# Altium schematic sheet 0260_GPU VREG_ VCCSA_GP.SchDoc
size 848 x 558 mm
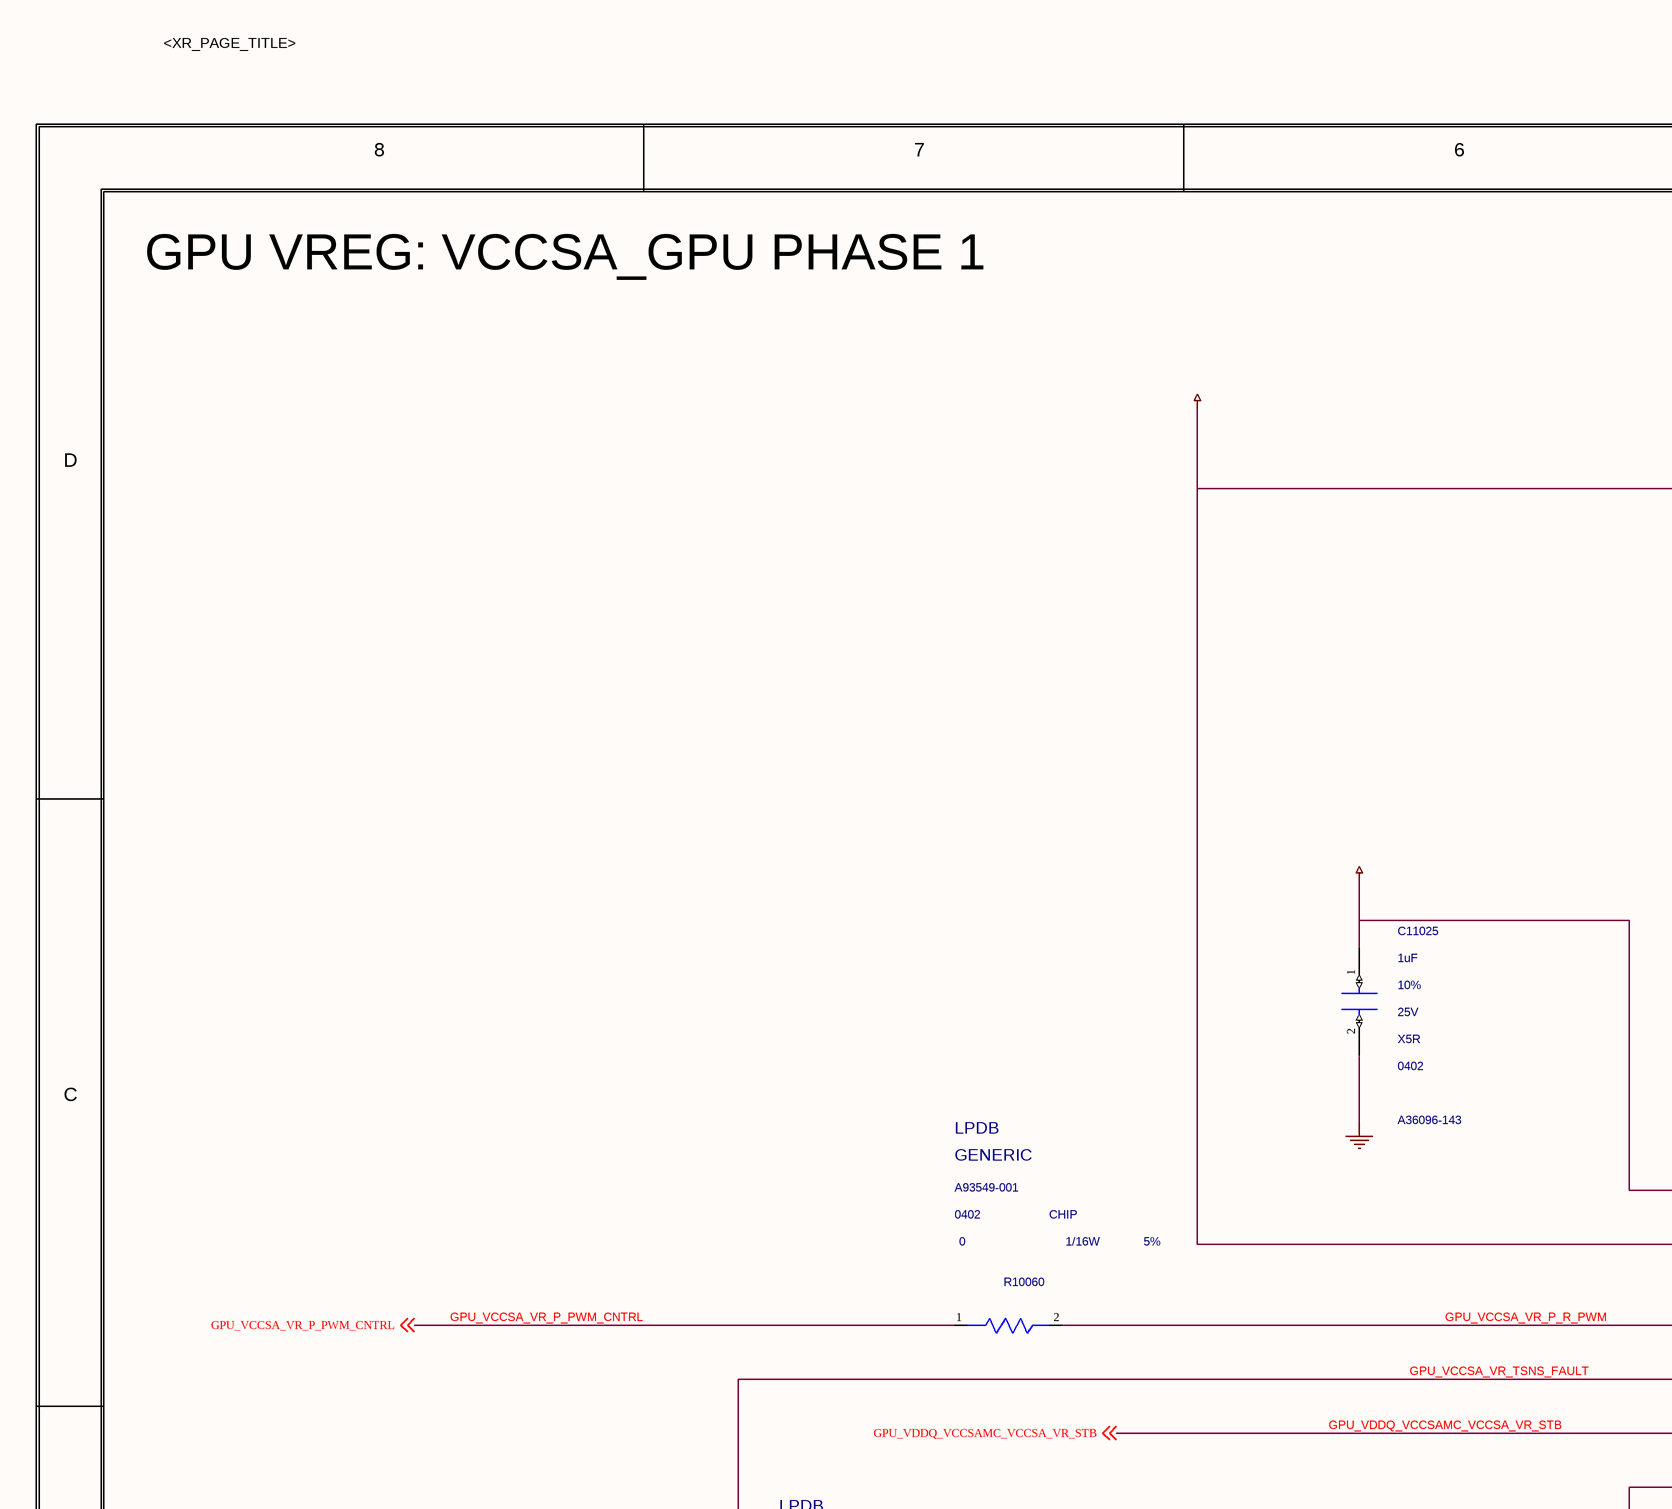
[diagram p0: 0260_GPU VREG_ VCCSA_GP.SchDoc, top left]
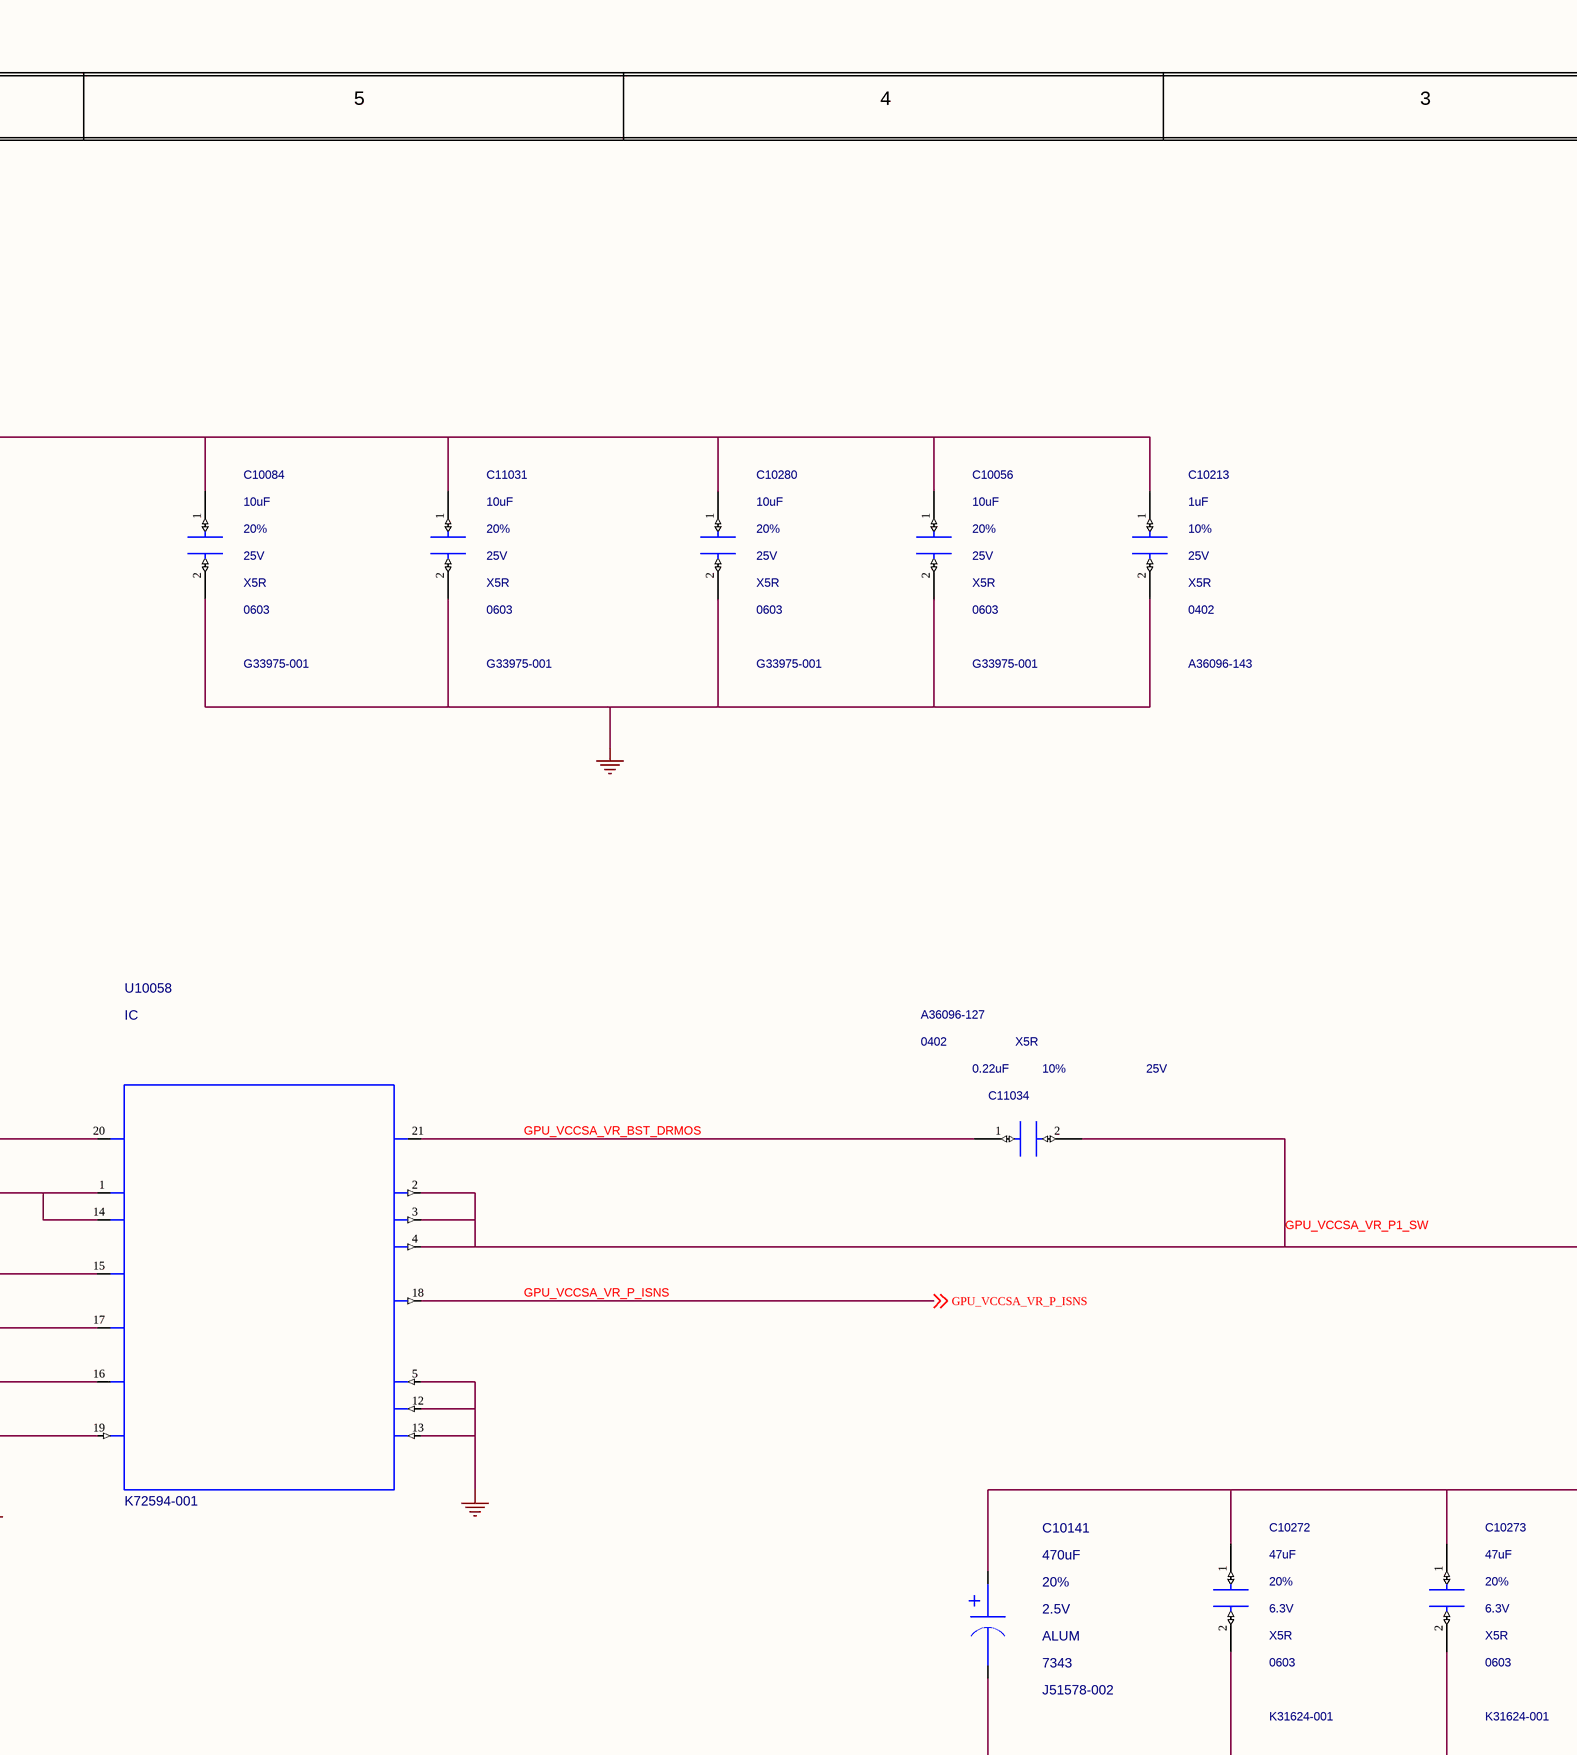
[diagram p1: 0260_GPU VREG_ VCCSA_GP.SchDoc, top middle]
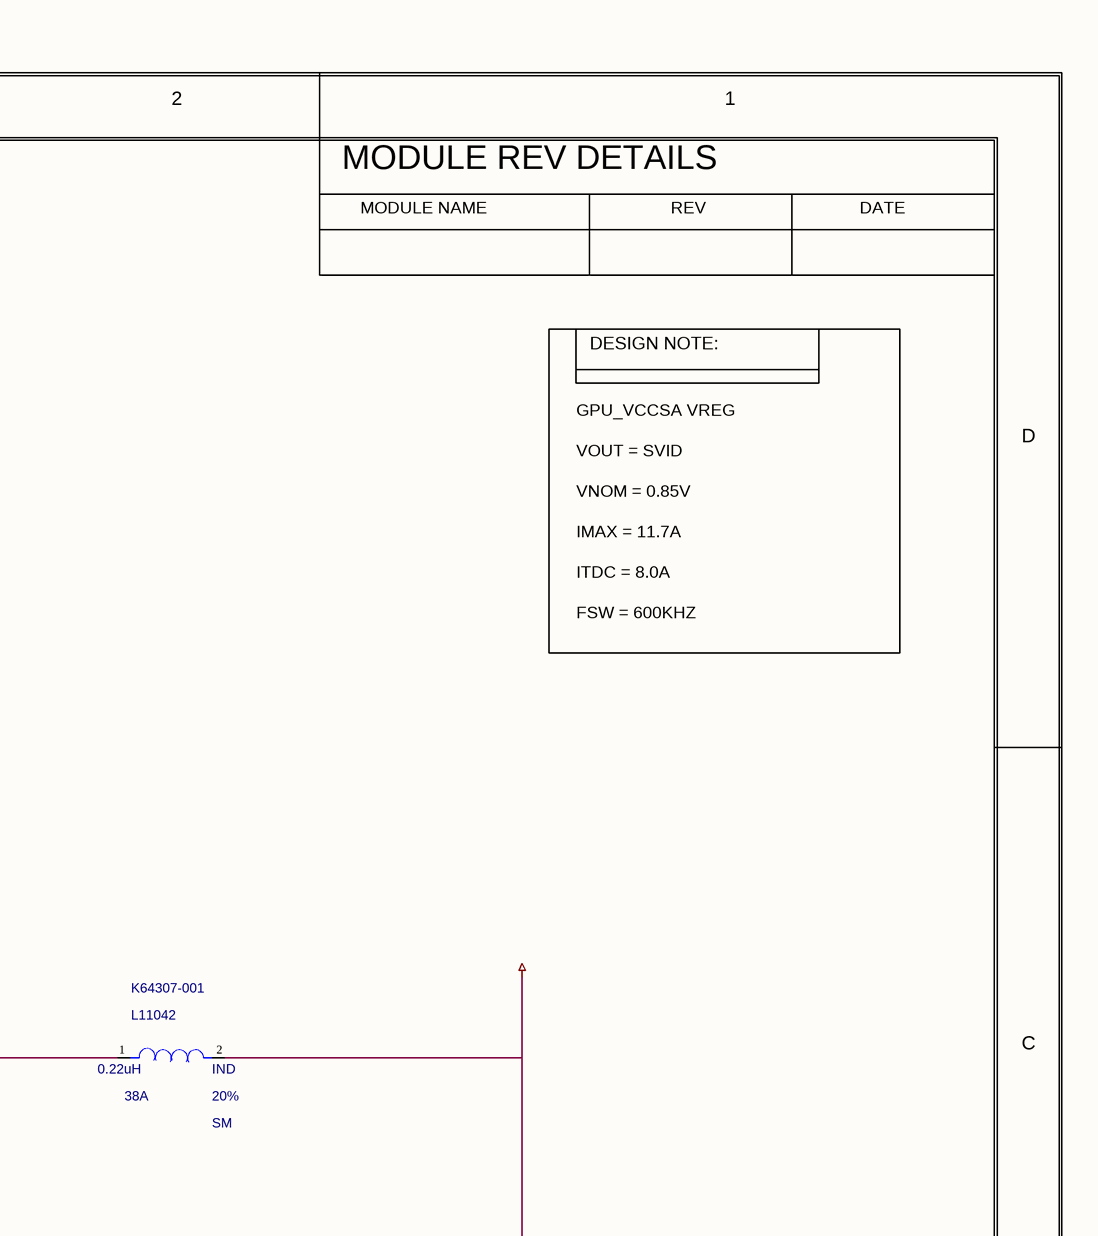
[diagram p2: 0260_GPU VREG_ VCCSA_GP.SchDoc, top right]
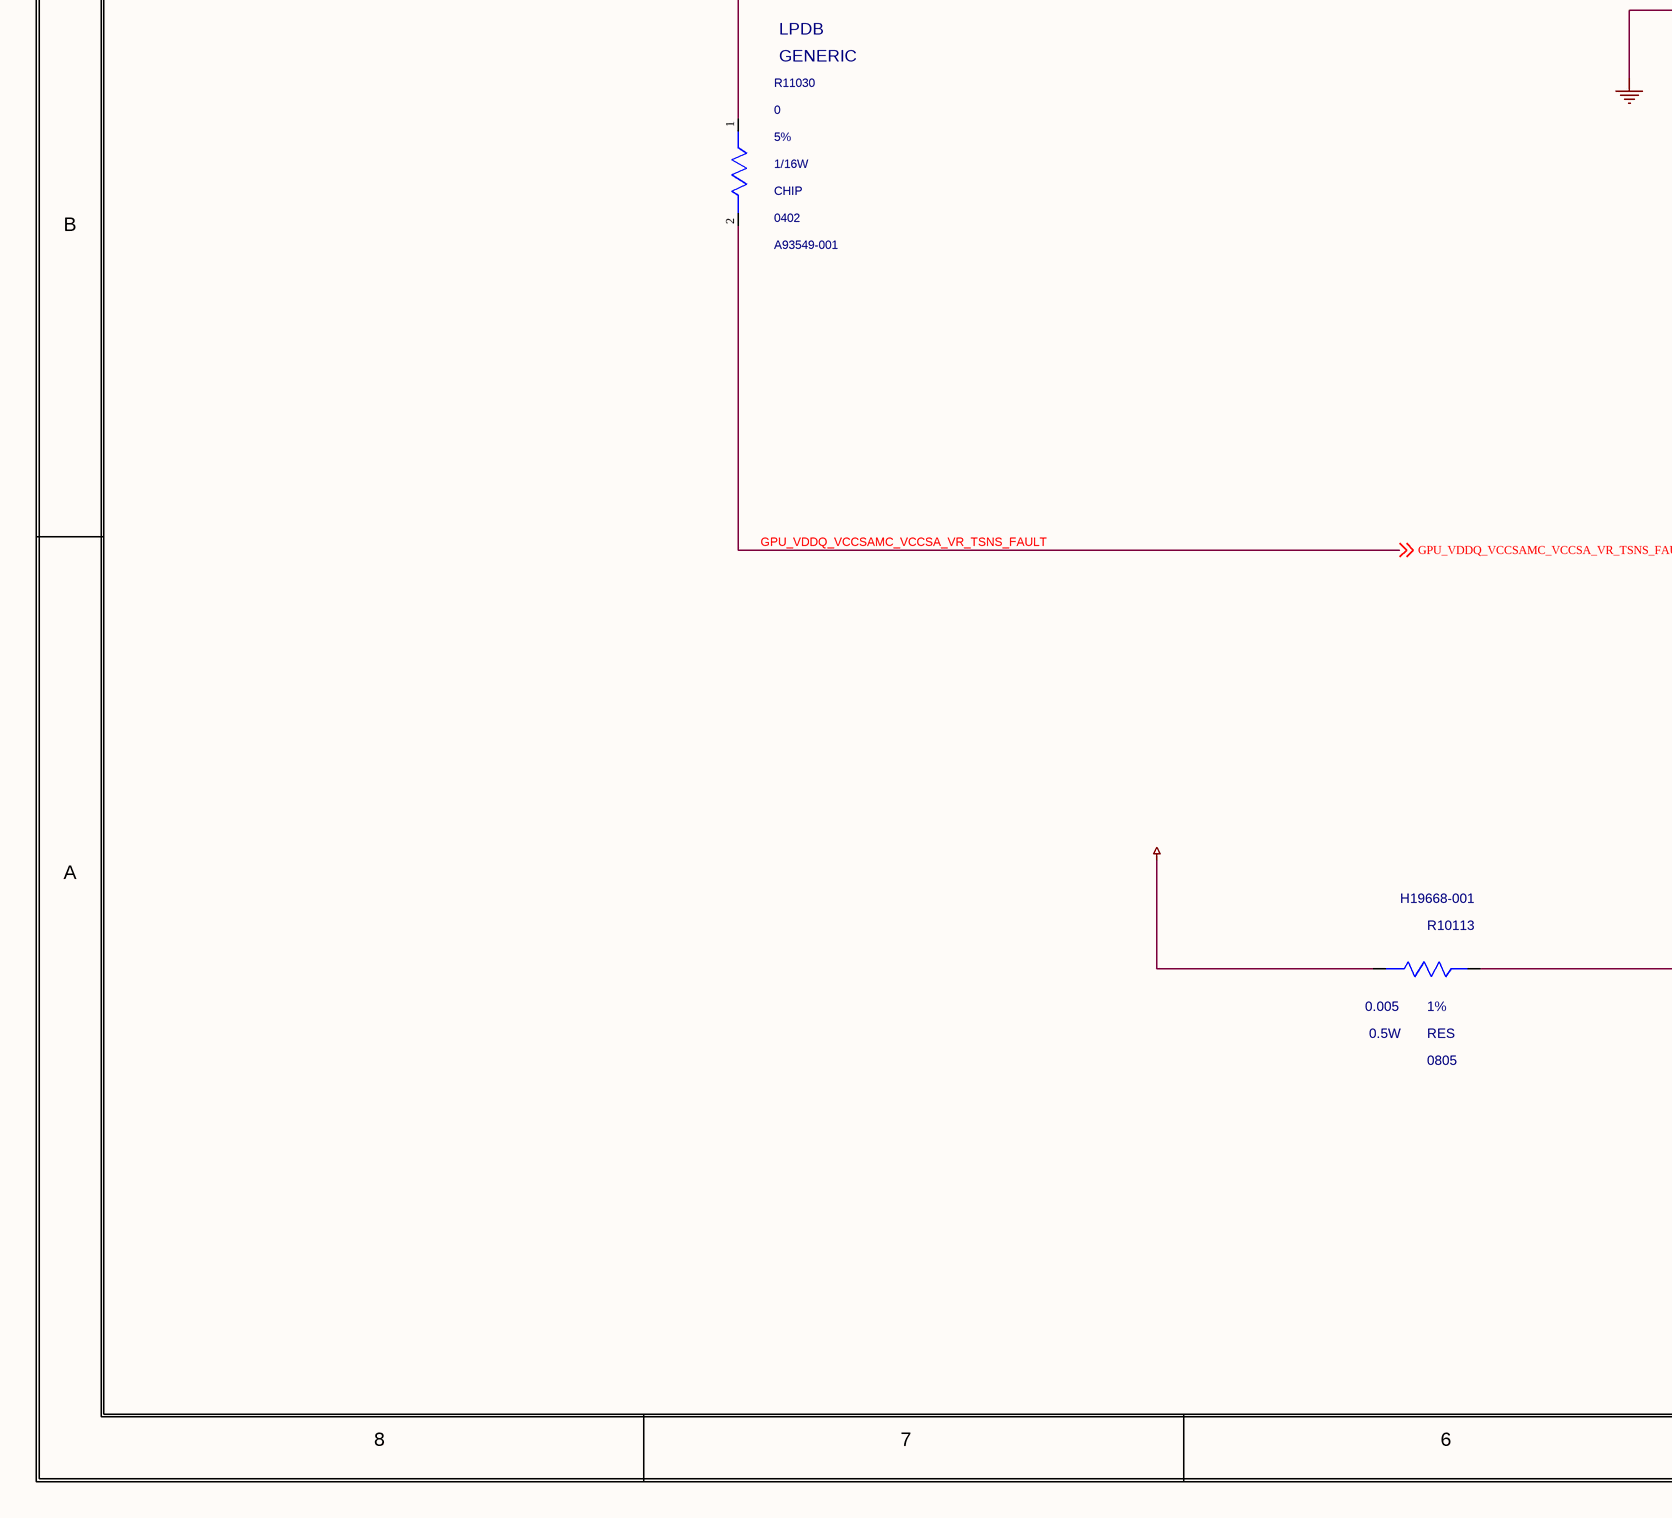
[diagram p3: 0260_GPU VREG_ VCCSA_GP.SchDoc, bottom left]
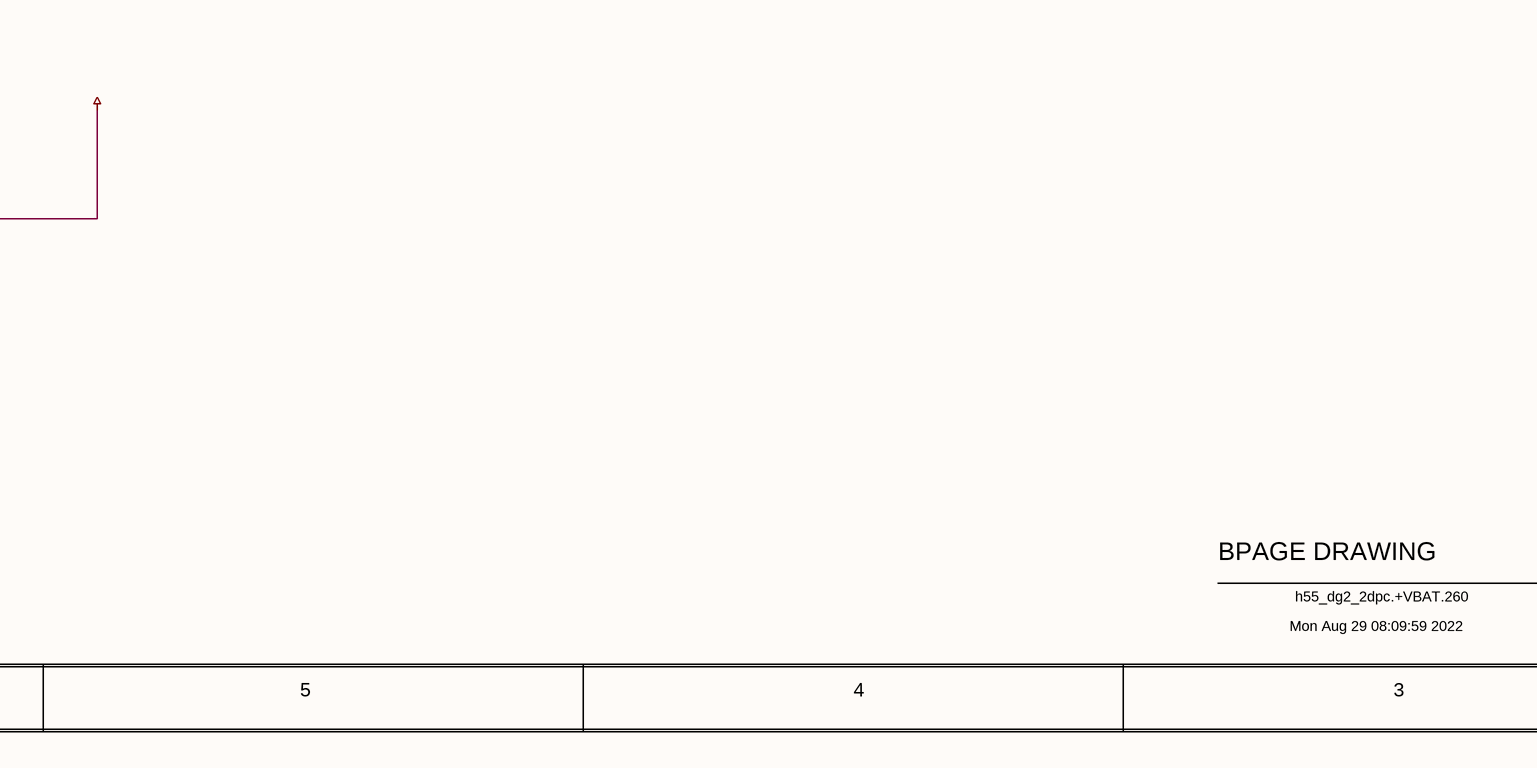
[diagram p4: 0260_GPU VREG_ VCCSA_GP.SchDoc, bottom middle]
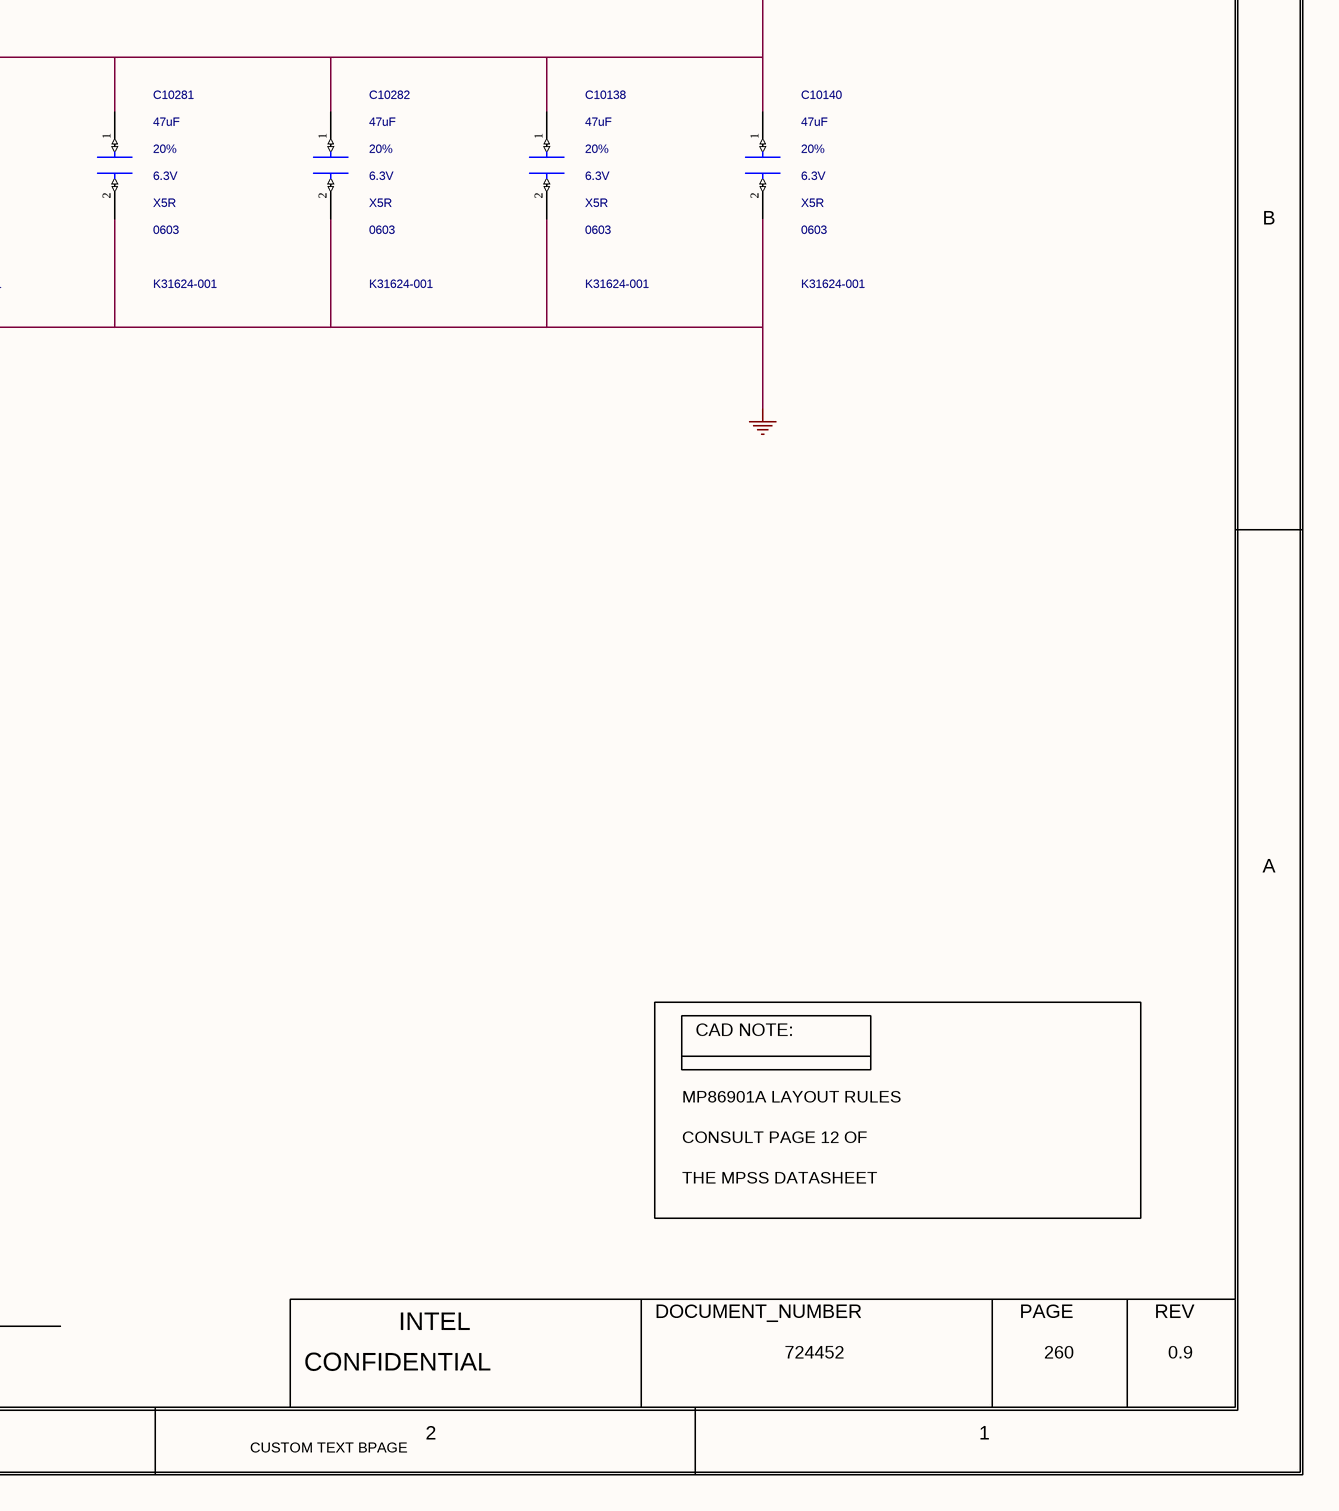
[diagram p5: 0260_GPU VREG_ VCCSA_GP.SchDoc, bottom right]

## Parts
C10056  10uF  MATERIAL: X5R  PACK_TYPE: 0603  PART_NUMBER: G33975-001  TOLERANCE: 20%  VOLTAGE: 25V  [SMC0603IA]
C10084  10uF  MATERIAL: X5R  PACK_TYPE: 0603  PART_NUMBER: G33975-001  TOLERANCE: 20%  VOLTAGE: 25V  [SMC0603IA]
C10138  47uF  MATERIAL: X5R  PACK_TYPE: 0603  PART_NUMBER: K31624-001  TOLERANCE: 20%  VOLTAGE: 6.3V  [SMC0603ID]
C10140  47uF  MATERIAL: X5R  PACK_TYPE: 0603  PART_NUMBER: K31624-001  TOLERANCE: 20%  VOLTAGE: 6.3V  [SMC0603ID]
C10141  470uF  MATERIAL: ALUM  PACK_TYPE: 7343  PART_NUMBER: J51578-002  TOLERANCE: 20%  VOLTAGE: 2.5V  [CTK2_SMC_7500X4500_ALEL_MA]
C10213  1uF  MATERIAL: X5R  PACK_TYPE: 0402  PART_NUMBER: A36096-143  TOLERANCE: 10%  VOLTAGE: 25V  [SMC0402MA]
C10272  47uF  MATERIAL: X5R  PACK_TYPE: 0603  PART_NUMBER: K31624-001  TOLERANCE: 20%  VOLTAGE: 6.3V  [SMC0603ID]
C10273  47uF  MATERIAL: X5R  PACK_TYPE: 0603  PART_NUMBER: K31624-001  TOLERANCE: 20%  VOLTAGE: 6.3V  [SMC0603ID]
C10280  10uF  MATERIAL: X5R  PACK_TYPE: 0603  PART_NUMBER: G33975-001  TOLERANCE: 20%  VOLTAGE: 25V  [SMC0603IA]
C10281  47uF  MATERIAL: X5R  PACK_TYPE: 0603  PART_NUMBER: K31624-001  TOLERANCE: 20%  VOLTAGE: 6.3V  [SMC0603ID]
C10282  47uF  MATERIAL: X5R  PACK_TYPE: 0603  PART_NUMBER: K31624-001  TOLERANCE: 20%  VOLTAGE: 6.3V  [SMC0603ID]
C11025  1uF  MATERIAL: X5R  PACK_TYPE: 0402  PART_NUMBER: A36096-143  TOLERANCE: 10%  VOLTAGE: 25V  [SMC0402MA]
C11031  10uF  MATERIAL: X5R  PACK_TYPE: 0603  PART_NUMBER: G33975-001  TOLERANCE: 20%  VOLTAGE: 25V  [SMC0603IA]
C11034  0.22uF  MATERIAL: X5R  PACK_TYPE: 0402  PART_NUMBER: A36096-127  TOLERANCE: 10%  VOLTAGE: 25V  [SMC1005MB]
L11042  0.22uH  CURRENT: 38A  MATERIAL: IND  PACK_TYPE: SM  PART_NUMBER: K64307-001  TOLERANCE: 20%  [CTK2_SM_7600X6800_MA]
R10060  0  MATERIAL: CHIP  PACK_TYPE: 0402  PART_NUMBER: A93549-001  TOLERANCE: 5%  WATTAGE: 1/16W  IP: GENERIC  FP_TECH: LPDB  [SMR0402IA]
R10113  0.005  MATERIAL: RES  PACK_TYPE: 0805  PART_NUMBER: H19668-001  TOLERANCE: 1%  WATTAGE: 0.5W  [CTK2_SM0805_2150X1350_MA]
R11030  0  MATERIAL: CHIP  PACK_TYPE: 0402  PART_NUMBER: A93549-001  TOLERANCE: 5%  WATTAGE: 1/16W  IP: GENERIC  FP_TECH: LPDB  [SMR0402IA]
U10058  MATERIAL: IC  PART_NUMBER: K72594-001  [CTK1_LCC21_3100X4100_400_DF3P_MA_VR]  (hidden comment: C_MP86901)

## Nets
+V3P3S_GPU: C11025.1(A) U10058.20(VCC)
+VBATA_DG2: R10113.1(A)
+VBATA_VCCSA_GPU: C10056.1(A) C10084.1(A) C10213.1(A) C10280.1(A) C11031.1(A) R10113.2(B) U10058.1(VIN_1) U10058.14(VIN_2)
+VCCSA_GPU: C10138.1(A) C10140.1(A) C10141.1(A) C10272.1(A) C10273.1(A) C10281.1(A) C10282.1(A) L11042.2(INB)
GND: C10056.2(B) C10084.2(B) C10138.2(B) C10140.2(B) C10141.2(B) C10213.2(B) C10272.2(B) C10273.2(B) C10280.2(B) C10281.2(B) C10282.2(B) C11025.2(B) C11031.2(B) U10058.5(PGND_1) U10058.12(PGND_2) U10058.13(PGND_3) U10058.19(AGND)
GPU_VCCSA_VR_BST_DRMOS: C11034.1(A) U10058.21(BST)
GPU_VCCSA_VR_P1_SW: C11034.2(B) L11042.1(INA) U10058.2(SW_1) U10058.3(SW_2) U10058.4(SW_3)
GPU_VCCSA_VR_P_ISNS: U10058.18(CS) ; off-sheet GPU_VCCSA_VR_P_ISNS
GPU_VCCSA_VR_P_PWM_CNTRL: R10060.1(A) ; off-sheet GPU_VCCSA_VR_P_PWM_CNTRL
GPU_VCCSA_VR_P_R_PWM: R10060.2(B) U10058.15(PWM)
GPU_VCCSA_VR_TSNS_FAULT: R11030.1(A) U10058.17(VTEMP_FLT)
GPU_VDDQ_VCCSAMC_VCCSA_VR_STB: U10058.16(SYNC) ; off-sheet GPU_VDDQ_VCCSAMC_VCCSA_VR_STB
GPU_VDDQ_VCCSAMC_VCCSA_VR_TSNS_FAULT: R11030.2(B) ; off-sheet GPU_VDDQ_VCCSAMC_VCCSA_VR_TSNS_FAULT

## Notes on the sheet
- <XR_PAGE_TITLE>
- 8
- 7
- 6
- 5
- 4
- 3
- 2
- 1
- MODULE REV DETAILS
- GPU VREG: VCCSA_GPU PHASE 1
- MODULE NAME
- REV
- DATE
- DESIGN NOTE:
- D
- GPU_VCCSA VREG
- VOUT = SVID
- VNOM = 0.85V
- IMAX = 11.7A
- ITDC = 8.0A
- FSW = 600KHZ
- C
- B
- A
- CAD NOTE:
- MP86901A LAYOUT RULES
- THE MPSS DATASHEET
- CONSULT PAGE 12 OF
- BPAGE DRAWING
- INTEL
- DOCUMENT_NUMBER
- PAGE
- Mon Aug 29 08:09:59 2022
- h55_dg2_2dpc.+VBAT.260
- CONFIDENTIAL
- 724452
- 260
- 0.9
- CUSTOM TEXT BPAGE

## Library data of the parts
C10056 = CAP: CDS_PHYS_PART_NAME: CAP_0603-G33975-001,X5R,10UF,25V,20%,LPDB,GENERIC; OriginalSymbolOrigin: (-50,25); XY: (1400,3450); VER: 1; ROT: 0; PHYS_PAGE: 260; LOCATION: C10056; DRAWING: @RVP1_ADL_SB_ADP_S_DDR5_SODIMM_2DPC_LIB.H55_DG2_2DPC(SCH_1):PAGE434; CDS_LIB: discrete; PCB Footprint: SMC0603IA; CHIPS_PART_NAME: CAP; CDS_PART_NAME: CAP_0603-G33975-001,X5R,10UF,25V,20%,LPDB,GENERIC; CDS_LOCATION: C10056
C10084 = CAP: CDS_PHYS_PART_NAME: CAP_0603-G33975-001,X5R,10UF,25V,20%,LPDB,GENERIC; OriginalSymbolOrigin: (-50,25); XY: (50,3450); VER: 1; ROT: 0; PHYS_PAGE: 260; LOCATION: C10084; DRAWING: @RVP1_ADL_SB_ADP_S_DDR5_SODIMM_2DPC_LIB.H55_DG2_2DPC(SCH_1):PAGE434; CDS_LIB: discrete; PCB Footprint: SMC0603IA; CHIPS_PART_NAME: CAP; CDS_PART_NAME: CAP_0603-G33975-001,X5R,10UF,25V,20%,LPDB,GENERIC; CDS_LOCATION: C10084
C10138 = CAP: CDS_PHYS_PART_NAME: CAP_0603-K31624-001,X5R,47UF,6.3V,20%,LPDB,GENERIC; OriginalSymbolOrigin: (-50,25); XY: (3550,1500); VER: 1; ROT: 0; PHYS_PAGE: 260; LOCATION: C10138; DRAWING: @RVP1_ADL_SB_ADP_S_DDR5_SODIMM_2DPC_LIB.H55_DG2_2DPC(SCH_1):PAGE434; CDS_LIB: discrete; PCB Footprint: SMC0603ID; CHIPS_PART_NAME: CAP; CDS_PART_NAME: CAP_0603-K31624-001,X5R,47UF,6.3V,20%,LPDB,GENERIC; CDS_LOCATION: C10138
C10140 = CAP: CDS_PHYS_PART_NAME: CAP_0603-K31624-001,X5R,47UF,6.3V,20%,LPDB,GENERIC; OriginalSymbolOrigin: (-50,25); XY: (3950,1500); VER: 1; ROT: 0; PHYS_PAGE: 260; LOCATION: C10140; DRAWING: @RVP1_ADL_SB_ADP_S_DDR5_SODIMM_2DPC_LIB.H55_DG2_2DPC(SCH_1):PAGE434; CDS_LIB: discrete; PCB Footprint: SMC0603ID; CHIPS_PART_NAME: CAP; CDS_PART_NAME: CAP_0603-K31624-001,X5R,47UF,6.3V,20%,LPDB,GENERIC; CDS_LOCATION: C10140
C10141 = C_CAPP: CDS_PHYS_PART_NAME: C_CAPP_7343-J51578-002,ALUM,470UF,2.5V,20%,TK2,GENERIC; CDS_LMAN_SYM_OUTLINE: -50,100,50,-50; FP_TECH: TK2; IP: GENERIC; ROOM: NONE; OriginalSymbolOrigin: (-50,75); XY: (1500,1450); VER: 1; ROT: 0; PHYS_PAGE: 260; LOCATION: C10141; DRAWING: @RVP1_ADL_SB_ADP_S_DDR5_SODIMM_2DPC_LIB.H55_DG2_2DPC(SCH_1):PAGE434; CDS_LIB: c_discrete; VARIANT: ?; PCB Footprint: CTK2_SMC_7500X4500_ALEL_MA; CHIPS_PART_NAME: C_CAPP; CDS_PART_NAME: C_CAPP_7343-J51578-002,ALUM,470UF,2.5V,20%,TK2,GENERIC; CDS_LOCATION: C10141
C10213 = CAP: CDS_PHYS_PART_NAME: CAP_0402-A36096-143,X5R,1UF,25V,10%,LPDB,GENERIC; OriginalSymbolOrigin: (-50,25); XY: (1800,3450); VER: 1; ROT: 0; PHYS_PAGE: 260; LOCATION: C10213; DRAWING: @RVP1_ADL_SB_ADP_S_DDR5_SODIMM_2DPC_LIB.H55_DG2_2DPC(SCH_1):PAGE434; CDS_LIB: discrete; PCB Footprint: SMC0402MA; CHIPS_PART_NAME: CAP; CDS_PART_NAME: CAP_0402-A36096-143,X5R,1UF,25V,10%,LPDB,GENERIC; CDS_LOCATION: C10213
C10272 = CAP: CDS_PHYS_PART_NAME: CAP_0603-K31624-001,X5R,47UF,6.3V,20%,LPDB,GENERIC; OriginalSymbolOrigin: (-50,25); XY: (1950,1500); VER: 1; ROT: 0; PHYS_PAGE: 260; LOCATION: C10272; DRAWING: @RVP1_ADL_SB_ADP_S_DDR5_SODIMM_2DPC_LIB.H55_DG2_2DPC(SCH_1):PAGE434; CDS_LIB: discrete; PCB Footprint: SMC0603ID; CHIPS_PART_NAME: CAP; CDS_PART_NAME: CAP_0603-K31624-001,X5R,47UF,6.3V,20%,LPDB,GENERIC; CDS_LOCATION: C10272
C10273 = CAP: CDS_PHYS_PART_NAME: CAP_0603-K31624-001,X5R,47UF,6.3V,20%,LPDB,GENERIC; OriginalSymbolOrigin: (-50,25); XY: (2350,1500); VER: 1; ROT: 0; PHYS_PAGE: 260; LOCATION: C10273; DRAWING: @RVP1_ADL_SB_ADP_S_DDR5_SODIMM_2DPC_LIB.H55_DG2_2DPC(SCH_1):PAGE434; CDS_LIB: discrete; PCB Footprint: SMC0603ID; CHIPS_PART_NAME: CAP; CDS_PART_NAME: CAP_0603-K31624-001,X5R,47UF,6.3V,20%,LPDB,GENERIC; CDS_LOCATION: C10273
C10280 = CAP: CDS_PHYS_PART_NAME: CAP_0603-G33975-001,X5R,10UF,25V,20%,LPDB,GENERIC; OriginalSymbolOrigin: (-50,25); XY: (1000,3450); VER: 1; ROT: 0; PHYS_PAGE: 260; LOCATION: C10280; DRAWING: @RVP1_ADL_SB_ADP_S_DDR5_SODIMM_2DPC_LIB.H55_DG2_2DPC(SCH_1):PAGE434; CDS_LIB: discrete; PCB Footprint: SMC0603IA; CHIPS_PART_NAME: CAP; CDS_PART_NAME: CAP_0603-G33975-001,X5R,10UF,25V,20%,LPDB,GENERIC; CDS_LOCATION: C10280
C10281 = CAP: CDS_PHYS_PART_NAME: CAP_0603-K31624-001,X5R,47UF,6.3V,20%,LPDB,GENERIC; OriginalSymbolOrigin: (-50,25); XY: (2750,1500); VER: 1; ROT: 0; PHYS_PAGE: 260; LOCATION: C10281; DRAWING: @RVP1_ADL_SB_ADP_S_DDR5_SODIMM_2DPC_LIB.H55_DG2_2DPC(SCH_1):PAGE434; CDS_LIB: discrete; PCB Footprint: SMC0603ID; CHIPS_PART_NAME: CAP; CDS_PART_NAME: CAP_0603-K31624-001,X5R,47UF,6.3V,20%,LPDB,GENERIC; CDS_LOCATION: C10281
C10282 = CAP: CDS_PHYS_PART_NAME: CAP_0603-K31624-001,X5R,47UF,6.3V,20%,LPDB,GENERIC; OriginalSymbolOrigin: (-50,25); XY: (3150,1500); VER: 1; ROT: 0; PHYS_PAGE: 260; LOCATION: C10282; DRAWING: @RVP1_ADL_SB_ADP_S_DDR5_SODIMM_2DPC_LIB.H55_DG2_2DPC(SCH_1):PAGE434; CDS_LIB: discrete; PCB Footprint: SMC0603ID; CHIPS_PART_NAME: CAP; CDS_PART_NAME: CAP_0603-K31624-001,X5R,47UF,6.3V,20%,LPDB,GENERIC; CDS_LOCATION: C10282
C11025 = CAP: CDS_PHYS_PART_NAME: CAP_0402-A36096-143,X5R,1UF,25V,10%,LPDB,GENERIC; OriginalSymbolOrigin: (-50,25); XY: (-850,2700); VER: 1; ROT: 0; PHYS_PAGE: 260; LOCATION: C11025; DRAWING: @RVP1_ADL_SB_ADP_S_DDR5_SODIMM_2DPC_LIB.H55_DG2_2DPC(SCH_1):PAGE434; CDS_LIB: discrete; PCB Footprint: SMC0402MA; CHIPS_PART_NAME: CAP; CDS_PART_NAME: CAP_0402-A36096-143,X5R,1UF,25V,10%,LPDB,GENERIC; CDS_LOCATION: C11025
C11031 = CAP: CDS_PHYS_PART_NAME: CAP_0603-G33975-001,X5R,10UF,25V,20%,LPDB,GENERIC; OriginalSymbolOrigin: (-50,25); XY: (500,3450); VER: 1; ROT: 0; PHYS_PAGE: 260; LOCATION: C11031; DRAWING: @RVP1_ADL_SB_ADP_S_DDR5_SODIMM_2DPC_LIB.H55_DG2_2DPC(SCH_1):PAGE434; CDS_LIB: discrete; PCB Footprint: SMC0603IA; CHIPS_PART_NAME: CAP; CDS_PART_NAME: CAP_0603-G33975-001,X5R,10UF,25V,20%,LPDB,GENERIC; CDS_LOCATION: C11031
C11034 = CAP#1: CHIPS_PART_NAME: CAP; CDS_PHYS_PART_NAME: CAP_0402-A36096-127,X5R,0.22UF,25V,10%,LPDB,GENERIC; OriginalSymbolOrigin: (-25,50); XY: (1575,2350); VER: 2; ROT: 0; PHYS_PAGE: 260; LOCATION: C11034; DRAWING: @RVP1_ADL_SB_ADP_S_DDR5_SODIMM_2DPC_LIB.H55_DG2_2DPC(SCH_1):PAGE434; CDS_LIB: discrete; PCB Footprint: SMC1005MB; CDS_PART_NAME: CAP_0402-A36096-127,X5R,0.22UF,25V,10%,LPDB,GENERIC; CDS_LOCATION: C11034
L11042 = C_INDUCTOR: CDS_PHYS_PART_NAME: C_INDUCTOR_SM-K64307-001,IND,0.22UH,20%,38A,TK2,GENERIC; CDS_LMAN_SYM_OUTLINE: -100,50,100,-50; FP_TECH: TK2; IP: GENERIC; ROOM: NONE; OriginalSymbolOrigin: (-75,25); XY: (3300,2500); VER: 1; ROT: 0; PHYS_PAGE: 260; LOCATION: L11042; DRAWING: @RVP1_ADL_SB_ADP_S_DDR5_SODIMM_2DPC_LIB.H55_DG2_2DPC(SCH_1):PAGE434; CDS_LIB: local; VARIANT: ?; PCB Footprint: CTK2_SM_7600X6800_MA; CHIPS_PART_NAME: C_INDUCTOR; CDS_PART_NAME: C_INDUCTOR_SM-K64307-001,IND,0.22UH,20%,38A,TK2,GENERIC; CDS_LOCATION: L11042
R10060 = RES#1: CHIPS_PART_NAME: RES; CDS_PHYS_PART_NAME: RES_0402-A93549-001,CHIP,0,5%,1/16W,LPDB,GENERIC; OriginalSymbolOrigin: (-75,25); XY: (-1500,2100); VER: 1; PHYS_PAGE: 260; LOCATION: R10060; DRAWING: @RVP1_ADL_SB_ADP_S_DDR5_SODIMM_2DPC_LIB.H55_DG2_2DPC(SCH_1):PAGE434; CDS_LIB: discrete; PCB Footprint: SMR0402IA; ROT: 0; CDS_PART_NAME: RES_0402-A93549-001,CHIP,0,5%,1/16W,LPDB,GENERIC; CDS_LOCATION: R10060
R10113 = C_RES#1: CHIPS_PART_NAME: C_RES; CDS_PHYS_PART_NAME: C_RES_0805-H19668-001,RES,0.005,1%,0.5W,TK2,GENERIC; CDS_LMAN_SYM_OUTLINE: -50,50,50,-50; FP_TECH: TK2; IP: GENERIC; ROOM: NONE; OriginalSymbolOrigin: (-75,25); XY: (-725,25); VER: 1; ROT: 0; PHYS_PAGE: 260; LOCATION: R10113; DRAWING: @RVP1_ADL_SB_ADP_S_DDR5_SODIMM_2DPC_LIB.H55_DG2_2DPC(SCH_1):PAGE434; CDS_LIB: c_discrete; VARIANT: ?; PCB Footprint: CTK2_SM0805_2150X1350_MA; CDS_PART_NAME: C_RES_0805-H19668-001,RES,0.005,1%,0.5W,TK2,GENERIC; CDS_LOCATION: R10113
R11030 = RES: CDS_PHYS_PART_NAME: RES_0402-A93549-001,CHIP,0,5%,1/16W,LPDB,GENERIC; OriginalSymbolOrigin: (-25,75); XY: (-2000,1500); VER: 2; SUB_ROOM: VCCSA; PHYS_PAGE: 260; LOCATION: R11030; DRAWING: @RVP1_ADL_SB_ADP_S_DDR5_SODIMM_2DPC_LIB.H55_DG2_2DPC(SCH_1):PAGE434; CDS_LIB: discrete; PCB Footprint: SMR0402IA; ROT: 0; CHIPS_PART_NAME: RES; CDS_PART_NAME: RES_0402-A93549-001,CHIP,0,5%,1/16W,LPDB,GENERIC; CDS_LOCATION: R11030
U10058 = C_MP86901: CDS_PHYS_PART_NAME: C_MP86901_LCC-K72594-001,IC,MP86901-BGLT,TK1,GENERIC; CDS_LMAN_SYM_OUTLINE: -250,400,250,-350; FP_TECH: TK1; IP: GENERIC; PACK_TYPE: LCC; ROOM: NONE; OriginalSymbolOrigin: (-275,400); XY: (150,2050); VER: 1; ROT: 0; PHYS_PAGE: 260; LOCATION: U10058; DRAWING: @RVP1_ADL_SB_ADP_S_DDR5_SODIMM_2DPC_LIB.H55_DG2_2DPC(SCH_1):PAGE434; CDS_LIB: local; VARIANT: ?; PCB Footprint: CTK1_LCC21_3100X4100_400_DF3P_MA_VR; CHIPS_PART_NAME: C_MP86901; CDS_PART_NAME: C_MP86901_LCC-K72594-001,IC,MP86901-BGLT,TK1,GENERIC; CDS_LOCATION: U10058